# Altium project STC11F04E_SOP20_UTo24G.PrjPCB
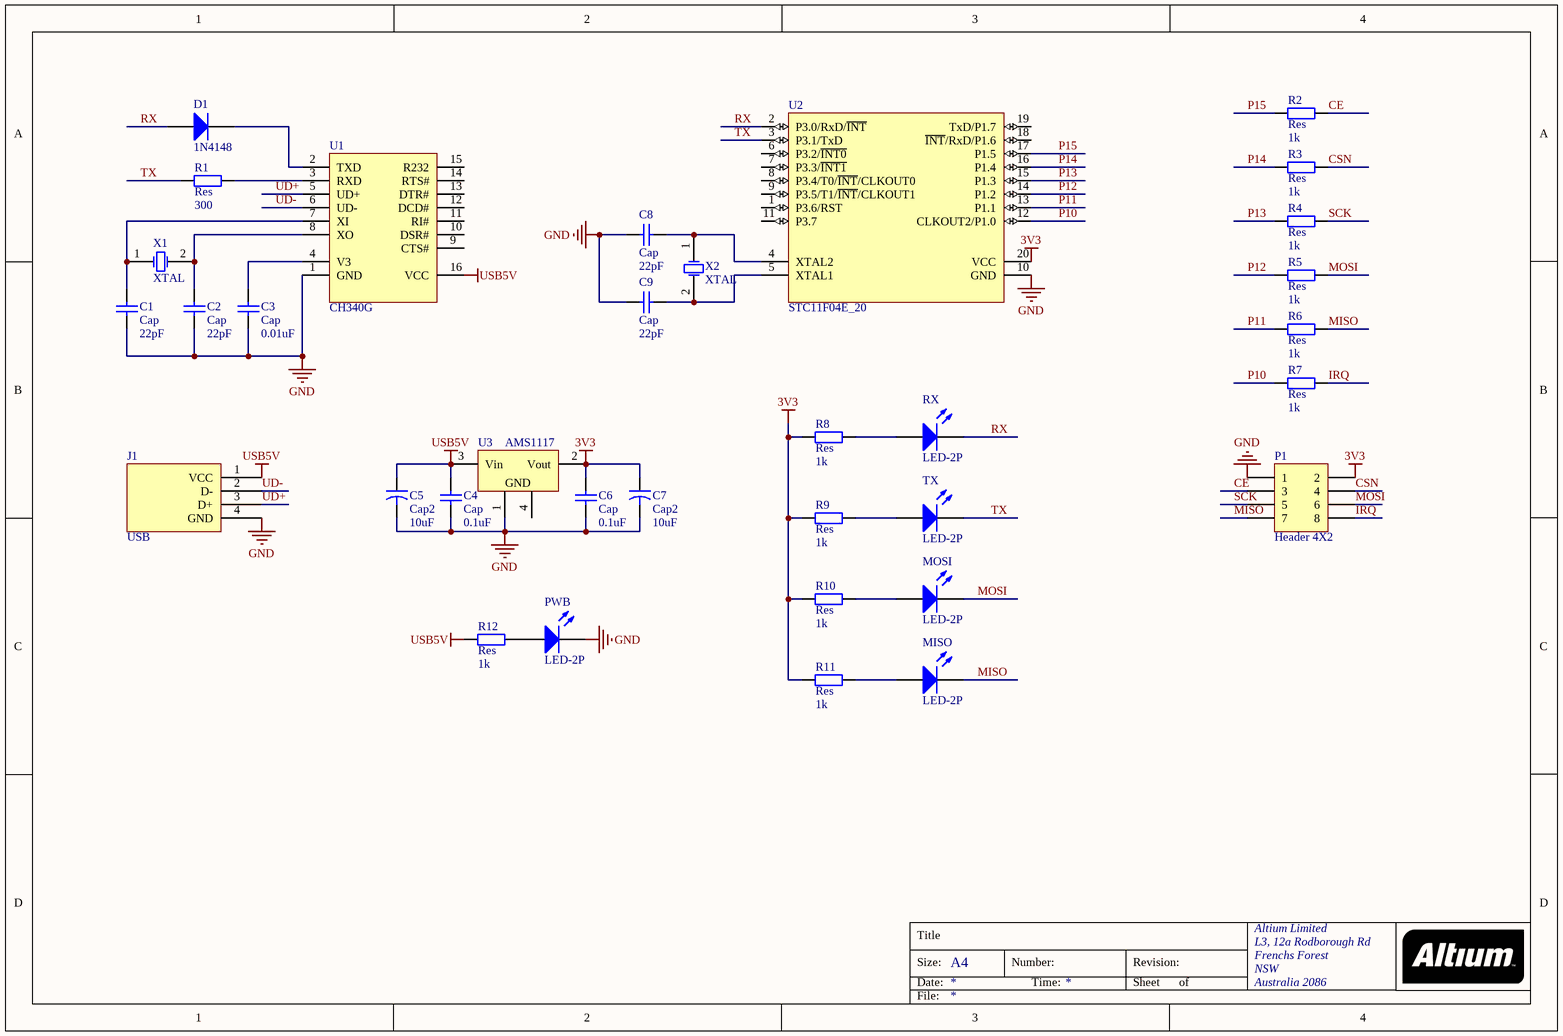
[diagram p0: STC11F04E_SOP20_UTo24G.SchDoc]
1 sheet, 34 parts. Net scope: global (net labels, ports and power ports of the same name join across sheets).
Board file: STC11F04E_SOP20_UTo24G.PcbDoc

## Sheet STC11F04E_SOP20_UTo24G.SchDoc
size A4; Organization: Altium Limited; Address1: L3, 12a Rodborough Rd; Address2: Frenchs Forest; Address3: NSW; Address4: Australia 2086

### Parts
C1  Cap  value 22pF  [C0805]
C2  Cap  value 22pF  [C0805]
C3  Cap  value 0.01uF  [C0805]
C4  Cap  value 0.1uF  [C0805]
C5  Cap2  value 10uF  [C1206A]
C6  Cap  value 0.1uF  [C0805]
C7  Cap2  value 10uF  [C1206A]
C8  Cap  value 22pF  [C0805]
C9  Cap  value 22pF  [C0805]
D1  1N4148  [C1206A]
J1  USB  [USB-A-G]
MISO  LED-2P  [C0805]
MOSI  LED-2P  [C0805]
P1  Header 4X2  [HDR2X4]
PWB  LED-2P  [C0805]
R1  Res  value 300  [0805]
R2  Res  value 1k  [0805]
R3  Res  value 1k  [0805]
R4  Res  value 1k  [0805]
R5  Res  value 1k  [0805]
R6  Res  value 1k  [0805]
R7  Res  value 1k  [0805]
R8  Res  value 1k  [0805]
R9  Res  value 1k  [0805]
R10  Res  value 1k  [0805]
R11  Res  value 1k  [0805]
R12  Res  value 1k  [0805]
RX  LED-2P  [C0805]
TX  LED-2P  [C0805]
U1  CH340G  [SOP16]
U2  STC11F04E_20  [SOP20]
U3  AMS1117  [SOT-223]
X1  XTAL  [XTAL1]
X2  XTAL  [XTAL1]

### Nets
3V3: C6.2 C7.1 P1.2 R8.1 R9.1 R10.1 R11.1 U2.20(VCC) U3.2(Vout)
GND: C1.2 C2.2 C3.1 C4.1 C5.2 C6.1 C7.2 C8.2 C9.2 J1.4(GND) P1.1 PWB.2(K) U1.1(GND) U2.10(GND) U3.1(GND)
USB5V: C4.2 C5.1 J1.1(VCC) R12.1 U1.16(VCC) U3.3(Vin)
CE: P1.3 R2.2
CSN: P1.4 R3.2
IRQ: P1.8 R7.2
MISO: MISO.2(K) P1.7 R6.2
MOSI: MOSI.2(K) P1.6 R5.2
P10: R7.1 U2.12(CLKOUT2/P1.0)
P11: R6.1 U2.13(P1.1)
P12: R5.1 U2.14(P1.2)
P13: R4.1 U2.15(P1.3)
P14: R3.1 U2.16(P1.4)
P15: R2.1 U2.17(P1.5)
RX: D1.1(A) RX.2(K) U2.2(P3.0/RxD/~{INT})
SCK: P1.5 R4.2
TX: R1.1 TX.2(K) U2.3(P3.1/TxD)
UD+: J1.3(D+) U1.5(UD+)
UD-: J1.2(D-) U1.6(UD-)
NetC1_1: C1.1 U1.7(XI) X1.1(OSC1)
NetC2_1: C2.1 U1.8(XO) X1.2(OSC2)
NetC3_2: C3.2 U1.4(V3)
NetC8_1: C8.1 U2.4(XTAL2) X2.1(OSC1)
NetC9_1: C9.1 U2.5(XTAL1) X2.2(OSC2)
NetD1_2: D1.2(K) U1.2(TXD)
NetMISO_1: MISO.1(A) R11.2
NetMOSI_1: MOSI.1(A) R10.2
NetPWB_1: PWB.1(A) R12.2
NetR1_2: R1.2 U1.3(RXD)
NetR8_2: R8.2 RX.1(A)
NetR9_2: R9.2 TX.1(A)

Not connected (* = marked no-connect by the designer): U1 9(CTS#) 10(DSR#) 11(RI#) 12(DCD#) 13(DTR#) 14(RTS#) 15(R232); U2 1(P3.6/RST) 6(P3.2/~{INT0}) 7(P3.3/~{INT1}) 8(P3.4/T0/~{INT}/CLKOUT0) 9(P3.5/T1/~{INT}/CLKOUT1) 11(P3.7) 18(~{INT}/RxD/P1.6) 19(TxD/P1.7); U3 4(GND)

### Notes on the sheet
- Title
- Size:
- Date:
- A4
- Number:
- Time:
- Revision:
- Sheet
- of
- File:

### Library data of the parts
C1-C4 C6 C8 C9 = Cap: Capacitor; Published: 8-Jun-2000; LatestRevisionDate: 17-Jul-2002; LatestRevisionNote: Re-released for DXP Platform.; PackageReference: RAD-0.3; Publisher: Altium Limited; PackageDescription: Radial Cap, Thru-Hole; 2 Leads; 0.3 in Pin Spacing
C5 C7 = Cap2: Capacitor; Published: 23-Sep-2002; PackageReference: CAPR5-4X5; Publisher: Altium Limited; PackageDescription: Capacitor; 2 Leads
D1 = 1N4148: 快速开关二极管
J1 = USB: USB-B
MISO MOSI PWB RX TX = LED-2P: 发光二极管
P1 = Header 4X2: Header, 4-Pin, Dual row; LatestRevisionDate: 17-Jul-2002; LatestRevisionNote: Re-released for DXP Platform.; Publisher: Altium Limited
R1-R12 = Res: Resistor; Published: 8-Jun-2000; LatestRevisionDate: 17-Jul-2002; LatestRevisionNote: Re-released for DXP Platform.; PackageReference: AXIAL-0.3; Publisher: Altium Limited; PackageDescription: Axial Device, Thru-Hole; 2 Leads; 0.3 in Pin Spacing
U1 = CH340G: USB 总线转接芯片
U2 = STC11F04E_20: 增强型8051单片机
U3 = AMS1117: 低压稳压器-1A
X1 X2 = XTAL: Crystal Oscillator; Published: 8-Jun-2000; LatestRevisionDate: 17-Jul-2002; LatestRevisionNote: Re-released for DXP Platform.; PackageReference: R38; Publisher: Altium Limited; PackageDescription: Crystal, Thru-Hole; 2 Leads; Body 3.1 x 8.2 mm (Dia.xH)